# EAGLE schematic ARC Lighting v1.2 (EAGLE 6.5.0)
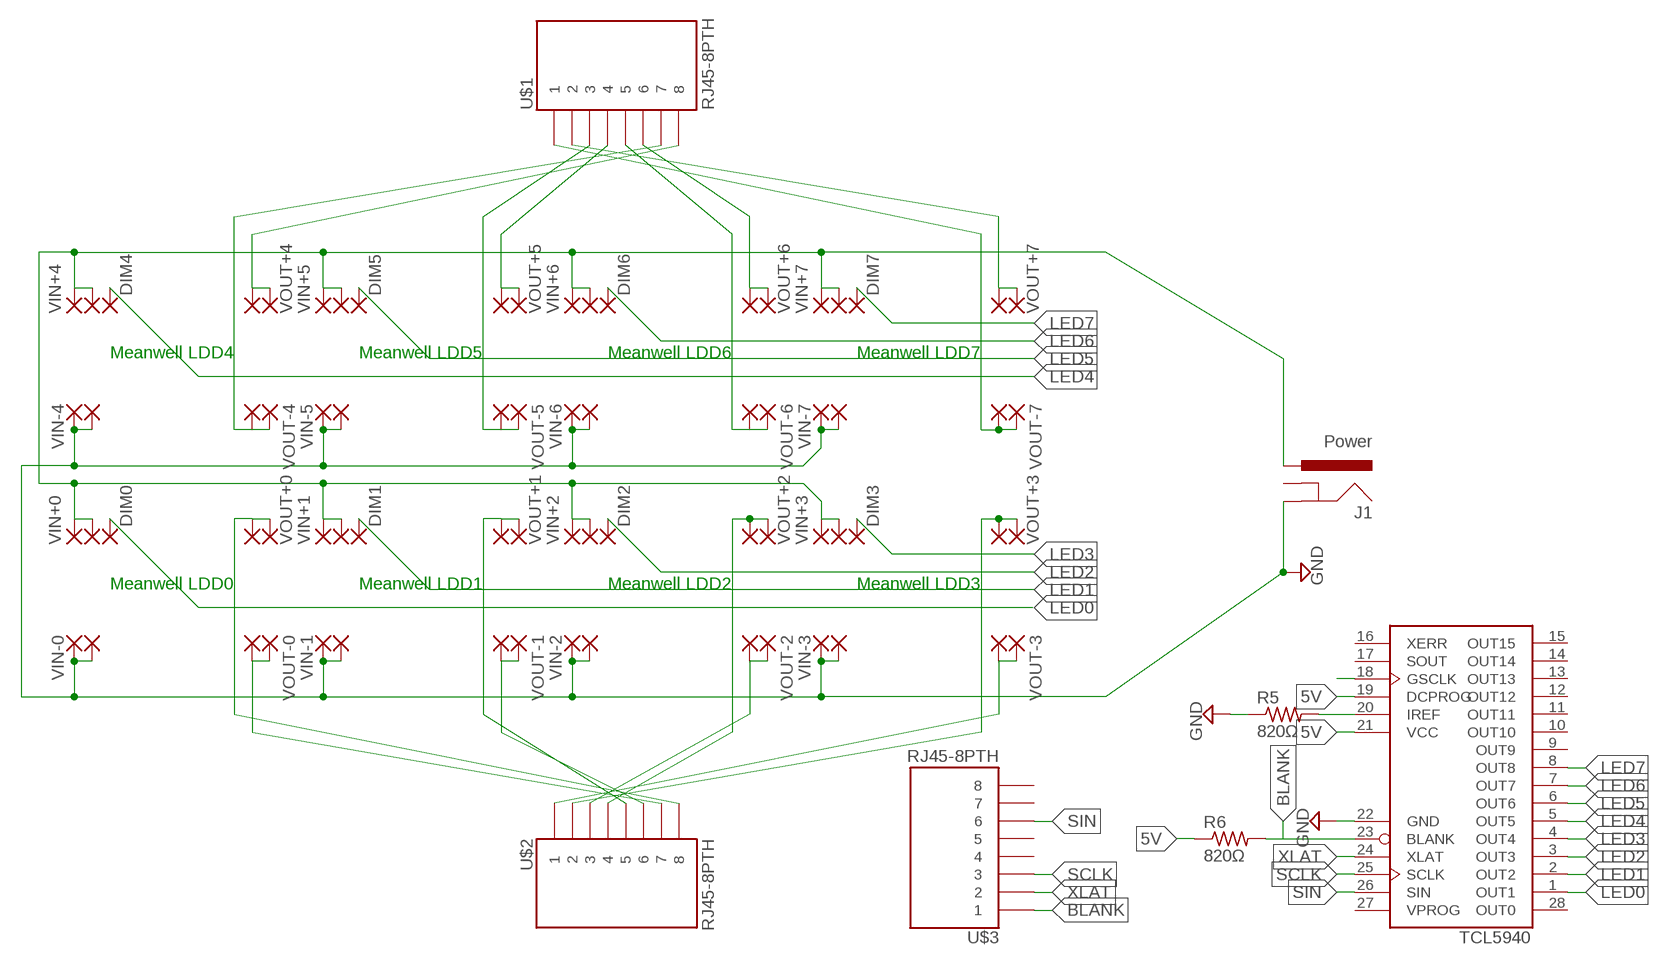
[diagram p0: schematic, sheet 1]

## Parts
DIM0  2,15/1,0  [2,15/1,0]
DIM1  2,15/1,0  [2,15/1,0]
DIM2  2,15/1,0  [2,15/1,0]
DIM3  2,15/1,0  [2,15/1,0]
DIM4  2,15/1,0  [2,15/1,0]
DIM5  2,15/1,0  [2,15/1,0]
DIM6  2,15/1,0  [2,15/1,0]
DIM7  2,15/1,0  [2,15/1,0]
I+0  2,15/1,0  [2,15/1,0]
I+1  2,15/1,0  [2,15/1,0]
I+2  2,15/1,0  [2,15/1,0]
I+3  2,15/1,0  [2,15/1,0]
I+4  2,15/1,0  [2,15/1,0]
I+5  2,15/1,0  [2,15/1,0]
I+6  2,15/1,0  [2,15/1,0]
I+7  2,15/1,0  [2,15/1,0]
I-0  2,15/1,0  [2,15/1,0]
I-1  2,15/1,0  [2,15/1,0]
I-2  2,15/1,0  [2,15/1,0]
I-3  2,15/1,0  [2,15/1,0]
I-4  2,15/1,0  [2,15/1,0]
I-5  2,15/1,0  [2,15/1,0]
I-6  2,15/1,0  [2,15/1,0]
I-7  2,15/1,0  [2,15/1,0]
IC1  TCL5940  [DIP28]
J1  Power  POWER_JACKPTH_BREAD  [POWER_JACK_PTH_BREAD]
O+0  2,15/1,0  [2,15/1,0]
O+1  2,15/1,0  [2,15/1,0]
O+2  2,15/1,0  [2,15/1,0]
O+3  2,15/1,0  [2,15/1,0]
O+4  2,15/1,0  [2,15/1,0]
O+5  2,15/1,0  [2,15/1,0]
O+6  2,15/1,0  [2,15/1,0]
O+7  2,15/1,0  [2,15/1,0]
O-0  2,15/1,0  [2,15/1,0]
O-1  2,15/1,0  [2,15/1,0]
O-2  2,15/1,0  [2,15/1,0]
O-3  2,15/1,0  [2,15/1,0]
O-4  2,15/1,0  [2,15/1,0]
O-5  2,15/1,0  [2,15/1,0]
O-6  2,15/1,0  [2,15/1,0]
O-7  2,15/1,0  [2,15/1,0]
R5  820Ω  R-US_0204/7  [0204/7]
R6  820Ω  R-US_0204/7  [0204/7]
U$1  RJ45-8PTH  [RJ45-8]
U$2  RJ45-8PTH  [RJ45-8]
U$3  RJ45-8PTH  [RJ45-8]
VIN+0  2,15/1,0  [2,15/1,0]
VIN+1  2,15/1,0  [2,15/1,0]
VIN+2  2,15/1,0  [2,15/1,0]
VIN+3  2,15/1,0  [2,15/1,0]
VIN+4  2,15/1,0  [2,15/1,0]
VIN+5  2,15/1,0  [2,15/1,0]
VIN+6  2,15/1,0  [2,15/1,0]
VIN+7  2,15/1,0  [2,15/1,0]
VIN-0  2,15/1,0  [2,15/1,0]
VIN-1  2,15/1,0  [2,15/1,0]
VIN-2  2,15/1,0  [2,15/1,0]
VIN-3  2,15/1,0  [2,15/1,0]
VIN-4  2,15/1,0  [2,15/1,0]
VIN-5  2,15/1,0  [2,15/1,0]
VIN-6  2,15/1,0  [2,15/1,0]
VIN-7  2,15/1,0  [2,15/1,0]
VOUT+0  2,15/1,0  [2,15/1,0]
VOUT+1  2,15/1,0  [2,15/1,0]
VOUT+2  2,15/1,0  [2,15/1,0]
VOUT+3  2,15/1,0  [2,15/1,0]
VOUT+4  2,15/1,0  [2,15/1,0]
VOUT+5  2,15/1,0  [2,15/1,0]
VOUT+6  2,15/1,0  [2,15/1,0]
VOUT+7  2,15/1,0  [2,15/1,0]
VOUT-0  2,15/1,0  [2,15/1,0]
VOUT-1  2,15/1,0  [2,15/1,0]
VOUT-2  2,15/1,0  [2,15/1,0]
VOUT-3  2,15/1,0  [2,15/1,0]
VOUT-4  2,15/1,0  [2,15/1,0]
VOUT-5  2,15/1,0  [2,15/1,0]
VOUT-6  2,15/1,0  [2,15/1,0]
VOUT-7  2,15/1,0  [2,15/1,0]

## Nets
5V [1.5A]: IC1.19(DCPROG) IC1.21(VCC) R6.1
12V [1.5A]: I+0.1(P) I+1.1(P) I+2.1(P) I+3.1(P) I+4.1(P) I+5.1(P) I+6.1(P) I+7.1(P) J1.PWR VIN+0.1(P) VIN+1.1(P) VIN+2.1(P) VIN+3.1(P) VIN+4.1(P) VIN+5.1(P) VIN+6.1(P) VIN+7.1(P)
BLANK [1.5A]: IC1.23(BLANK) R6.2 U$3.1
GND [1.5A]: I-0.1(P) I-1.1(P) I-2.1(P) I-3.1(P) I-4.1(P) I-5.1(P) I-6.1(P) I-7.1(P) IC1.22(GND) J1.GND R5.1 VIN-0.1(P) VIN-1.1(P) VIN-2.1(P) VIN-3.1(P) VIN-4.1(P) VIN-5.1(P) VIN-6.1(P) VIN-7.1(P)
L1+ [1.5A]: O+1.1(P) U$2.5 VOUT+1.1(P)
L2+ [1.5A]: O+2.1(P) U$2.4 VOUT+2.1(P)
L2- [1.5A]: O-2.1(P) U$2.3 VOUT-2.1(P)
L3+ [1.5A]: O+3.1(P) U$2.2 VOUT+3.1(P)
L3- [1.5A]: O-3.1(P) U$2.1 VOUT-3.1(P)
L4- [1.5A]: O-4.1(P) U$1.7 VOUT-4.1(P)
L5+ [1.5A]: O+5.1(P) U$1.4 VOUT+5.1(P)
L5- [1.5A]: O-5.1(P) U$1.3 VOUT-5.1(P)
L6+ [1.5A]: O+6.1(P) U$1.6 VOUT+6.1(P)
L6- [1.5A]: O-6.1(P) U$1.5 VOUT-6.1(P)
L7+ [1.5A]: O+7.1(P) U$1.2 VOUT+7.1(P)
L7- [1.5A]: O-7.1(P) U$1.1 VOUT-7.1(P)
LED0 [1.5A]: DIM0.1(P) IC1.1(OUT1)
LED1 [1.5A]: DIM1.1(P) IC1.2(OUT2)
LED2 [1.5A]: DIM2.1(P) IC1.3(OUT3)
LED3 [1.5A]: DIM3.1(P) IC1.4(OUT4)
LED4 [1.5A]: DIM4.1(P) IC1.5(OUT5)
LED5 [1.5A]: DIM5.1(P) IC1.6(OUT6)
LED6 [1.5A]: DIM6.1(P) IC1.7(OUT7)
LED7 [1.5A]: DIM7.1(P) IC1.8(OUT8)
N$11 [1.5A]: IC1.18(GSCLK)
N$12 [1.5A]: IC1.20(IREF) R5.2
N$36 [1.5A]: O+4.1(P) U$1.8 VOUT+4.1(P)
N$37 [1.5A]: O+0.1(P) U$2.8 VOUT+0.1(P)
N$38 [1.5A]: O-0.1(P) U$2.7 VOUT-0.1(P)
N$39 [1.5A]: O-1.1(P) U$2.6 VOUT-1.1(P)
SCLK [1.5A]: IC1.25(SCLK) U$3.3
SIN [1.5A]: IC1.26(SIN) U$3.6
XLAT [1.5A]: IC1.24(XLAT) U$3.2
Unconnected: IC1.9(OUT9) IC1.10(OUT10) IC1.11(OUT11) IC1.12(OUT12) IC1.13(OUT13) IC1.14(OUT14) IC1.15(OUT15) IC1.16(XERR) IC1.17(SOUT) IC1.27(VPROG) IC1.28(OUT0) J1.GNDBREAK U$3.4 U$3.5 U$3.7 U$3.8

## Notes on the sheet
- Meanwell LDD4 | Meanwell LDD5 | Meanwell LDD6 | Meanwell LDD7
- Meanwell LDD0 | Meanwell LDD1 | Meanwell LDD2 | Meanwell LDD3

## Library data of the parts
DIM0 DIM1-DIM7 I+0 I+1-I+7 I-0 I-1-I-7 O+0 O+1-O+7 O-0 O-1-O-7 VIN+0 VIN+1-VIN+7 VIN-0 VIN-1-VIN-7 VOUT+0 VOUT+1-VOUT+7 VOUT-0 VOUT-1-VOUT-7 = wirepad:2,15/1,0: THROUGH-HOLE PAD
IC1 = tcl5940:TCL5940: 16-Channel 12-Bit LED Driver
J1 = SparkFun-Connectors:POWER_JACK: Power Jack This is the standard 5.5mm barrel jack for power. The PTH is the most common, proven, reliable, footprint. The Slot footprint only works if the mill layer is transmitted to the PCB fab house so be warned. Mating wall wart : TOL-00298 (and others); PROD_ID: PRT-10811
R5 R6 = resistor:R-US_: RESISTOR, American symbol
U$1-U$3 = SparkFun-Connectors:RJ45-8: RJ45 Jack Simple RJ45, 8-pin connection - connector for common Cat5, Cat5e, and Cat6 Ethernet cables. Footprint not yet proven in production. Connector sku is PRT-00643; Breakout PCB sku is BOB-00716.

## Net classes
0 default: width 0.178 mm, drill 0.356 mm, clearance 0.508 mm
1 8A: width 5.283 mm, drill 0.356 mm, clearance 0.508 mm
2 1A: width 0.356 mm, drill 0.356 mm, clearance 0.508 mm
4 1.5A: width 0.508 mm, clearance 0.508 mm